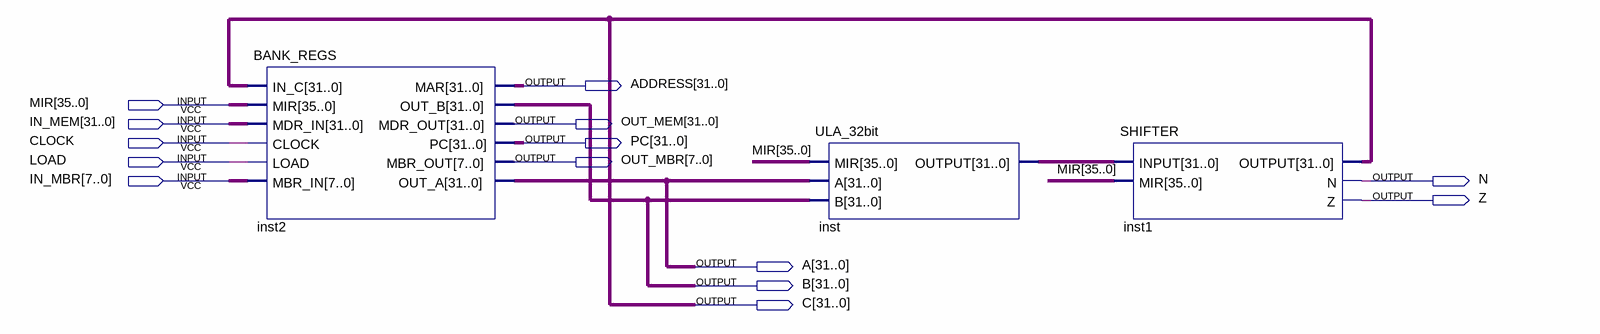
[diagram p0: schematic sheet]
// Quartus schematic DATAPATH.bdf as structural Verilog: 3 symbols, 14 pins
module DATAPATH (
  input  [35:0] MIR,
  input  [31:0] IN_MEM,
  input  CLOCK,
  input  LOAD,
  input  [7:0] IN_MBR,
  output [31:0] ADDRESS,
  output [31:0] OUT_MEM,
  output [31:0] PC,
  output [7:0] OUT_MBR,
  output N,
  output Z,
  output [31:0] A,
  output [31:0] B,
  output [31:0] C
);

  wire [31:0] inst_output;

  BANK_REGS inst2 (
    .IN_C(C), .MIR(MIR), .MDR_IN(IN_MEM), .CLOCK(CLOCK), .LOAD(LOAD), .MBR_IN(IN_MBR), .MAR(ADDRESS),
    .OUT_B(B), .MDR_OUT(OUT_MEM), .PC(PC), .MBR_OUT(OUT_MBR), .OUT_A(A));
  ULA_32bit inst (.MIR(MIR), .A(A), .B(B), .OUTPUT(inst_output));
  SHIFTER inst1 (.INPUT(inst_output), .MIR(MIR), .OUTPUT(C), .N(N), .Z(Z));
endmodule
